# Altium project PCB_Project_4.PrjPcb
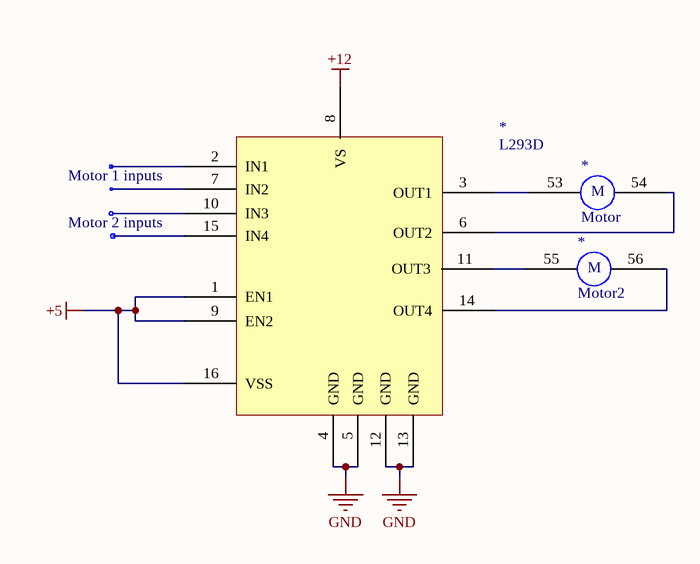
[diagram p0: Sheet1.SchDoc]
1 sheet, 3 parts. Net scope: global (net labels, ports and power ports of the same name join across sheets).
Board file: PCB1.PcbDoc

## Sheet Sheet1.SchDoc
size A; SheetNumber: 1; SheetTotal: 1

### Parts
L293D  L293D  [L293D]
Motor1  Motor2  [Motor]
Motor2  Motor  [Motor]

### Nets
+5: L293D.1(EN1) L293D.9(EN2) L293D.16(VSS)
+12: L293D.8(VS)
GND: L293D.4(GND) L293D.5(GND) L293D.12(GND) L293D.13(GND)
NetL293D_3: L293D.3(OUT1) Motor2.53
NetL293D_6: L293D.6(OUT2) Motor2.54
NetL293D_11: L293D.11(OUT3) Motor1.55
NetL293D_14: L293D.14(OUT4) Motor1.56

Not connected (* = marked no-connect by the designer): L293D 2(IN1) 7(IN2) 10(IN3) 15(IN4)

### Notes on the sheet
- (near L293D) Motor 1 inputs
- (near L293D) Motor 2 inputs
- (in symbol Motor) M
- (in symbol Motor2) M